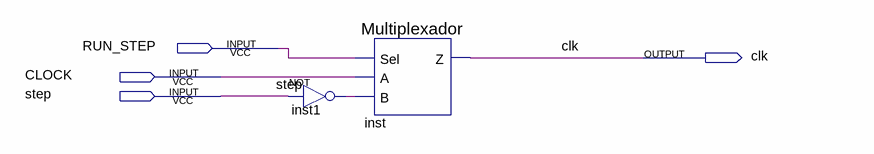
[diagram p0: schematic sheet]
// Quartus schematic RUN_STEP.bdf as structural Verilog: 2 symbols, 4 pins
module RUN_STEP (
  input  RUN_STEP,
  input  CLOCK,
  input  step,
  output clk
);

  wire inst1_out;

  not inst1 (inst1_out, step);
  Multiplexador inst (.Sel(RUN_STEP), .A(CLOCK), .B(inst1_out), .Z(clk));
endmodule
